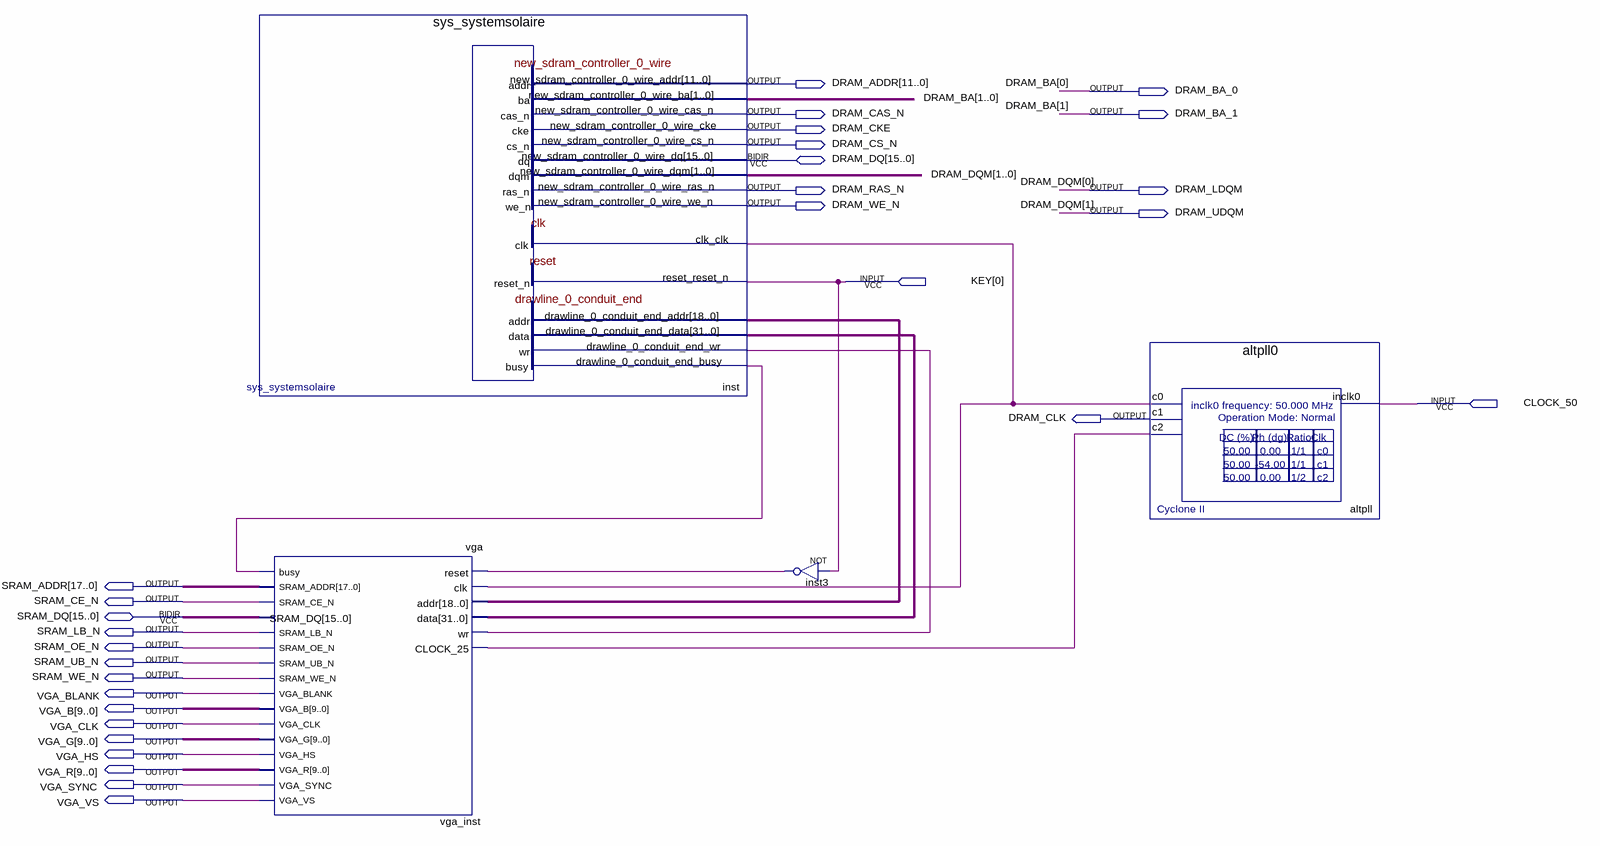
[diagram p0: schematic sheet]
// Quartus schematic systemesolaire.bdf as structural Verilog: 4 symbols, 29 pins
module systemesolaire (
  input  [0:0] KEY,
  input  CLOCK_50,
  inout  [15:0] DRAM_DQ,
  inout  [15:0] SRAM_DQ,
  output [11:0] DRAM_ADDR,
  output DRAM_BA_0,
  output DRAM_CAS_N,
  output DRAM_BA_1,
  output DRAM_CKE,
  output DRAM_CS_N,
  output DRAM_RAS_N,
  output DRAM_LDQM,
  output DRAM_WE_N,
  output DRAM_UDQM,
  output DRAM_CLK,
  output [17:0] SRAM_ADDR,
  output SRAM_CE_N,
  output SRAM_LB_N,
  output SRAM_OE_N,
  output SRAM_UB_N,
  output SRAM_WE_N,
  output VGA_BLANK,
  output [9:0] VGA_B,
  output VGA_CLK,
  output [9:0] VGA_G,
  output VGA_HS,
  output [9:0] VGA_R,
  output VGA_SYNC,
  output VGA_VS
);

  wire altpll_c0, altpll_c2, inst3_out, inst_drawline_0_conduit_end_wr, vga_inst_busy;
  wire [18:0] inst_drawline_0_conduit_end_addr;
  wire [31:0] inst_drawline_0_conduit_end_data;

  sys_systemsolaire inst (
    .clk_clk(altpll_c0), .reset_reset_n(KEY[0]), .drawline_0_conduit_end_busy(vga_inst_busy),
    .new_sdram_controller_0_wire_addr(DRAM_ADDR), .new_sdram_controller_0_wire_ba({DRAM_BA_1, DRAM_BA_0}),
    .new_sdram_controller_0_wire_cas_n(DRAM_CAS_N), .new_sdram_controller_0_wire_cke(DRAM_CKE),
    .new_sdram_controller_0_wire_cs_n(DRAM_CS_N), .new_sdram_controller_0_wire_dqm({DRAM_UDQM, DRAM_LDQM}),
    .new_sdram_controller_0_wire_ras_n(DRAM_RAS_N), .new_sdram_controller_0_wire_we_n(DRAM_WE_N),
    .drawline_0_conduit_end_addr(inst_drawline_0_conduit_end_addr),
    .drawline_0_conduit_end_data(inst_drawline_0_conduit_end_data),
    .drawline_0_conduit_end_wr(inst_drawline_0_conduit_end_wr), .new_sdram_controller_0_wire_dq(DRAM_DQ));
  vga vga_inst (
    .reset(inst3_out), .clk(altpll_c0), .addr(inst_drawline_0_conduit_end_addr),
    .data(inst_drawline_0_conduit_end_data), .wr(inst_drawline_0_conduit_end_wr), .CLOCK_25(altpll_c2),
    .busy(vga_inst_busy), .SRAM_ADDR(SRAM_ADDR), .SRAM_CE_N(SRAM_CE_N), .SRAM_LB_N(SRAM_LB_N),
    .SRAM_OE_N(SRAM_OE_N), .SRAM_UB_N(SRAM_UB_N), .SRAM_WE_N(SRAM_WE_N), .VGA_BLANK(VGA_BLANK),
    .VGA_B(VGA_B), .VGA_CLK(VGA_CLK), .VGA_G(VGA_G), .VGA_HS(VGA_HS), .VGA_R(VGA_R), .VGA_SYNC(VGA_SYNC),
    .VGA_VS(VGA_VS), .SRAM_DQ(SRAM_DQ));
  not inst3 (inst3_out, KEY[0]);
  altpll0 altpll (.inclk0(CLOCK_50), .c0(altpll_c0), .c1(DRAM_CLK), .c2(altpll_c2));

  // Other names for the same wires on the sheet: DRAM_BA[1:0] = {DRAM_BA_1, DRAM_BA_0};
  //   DRAM_DQM[1:0] = {DRAM_UDQM, DRAM_LDQM}
endmodule
